# Altium project final embedded smart_watch.PrjPcb
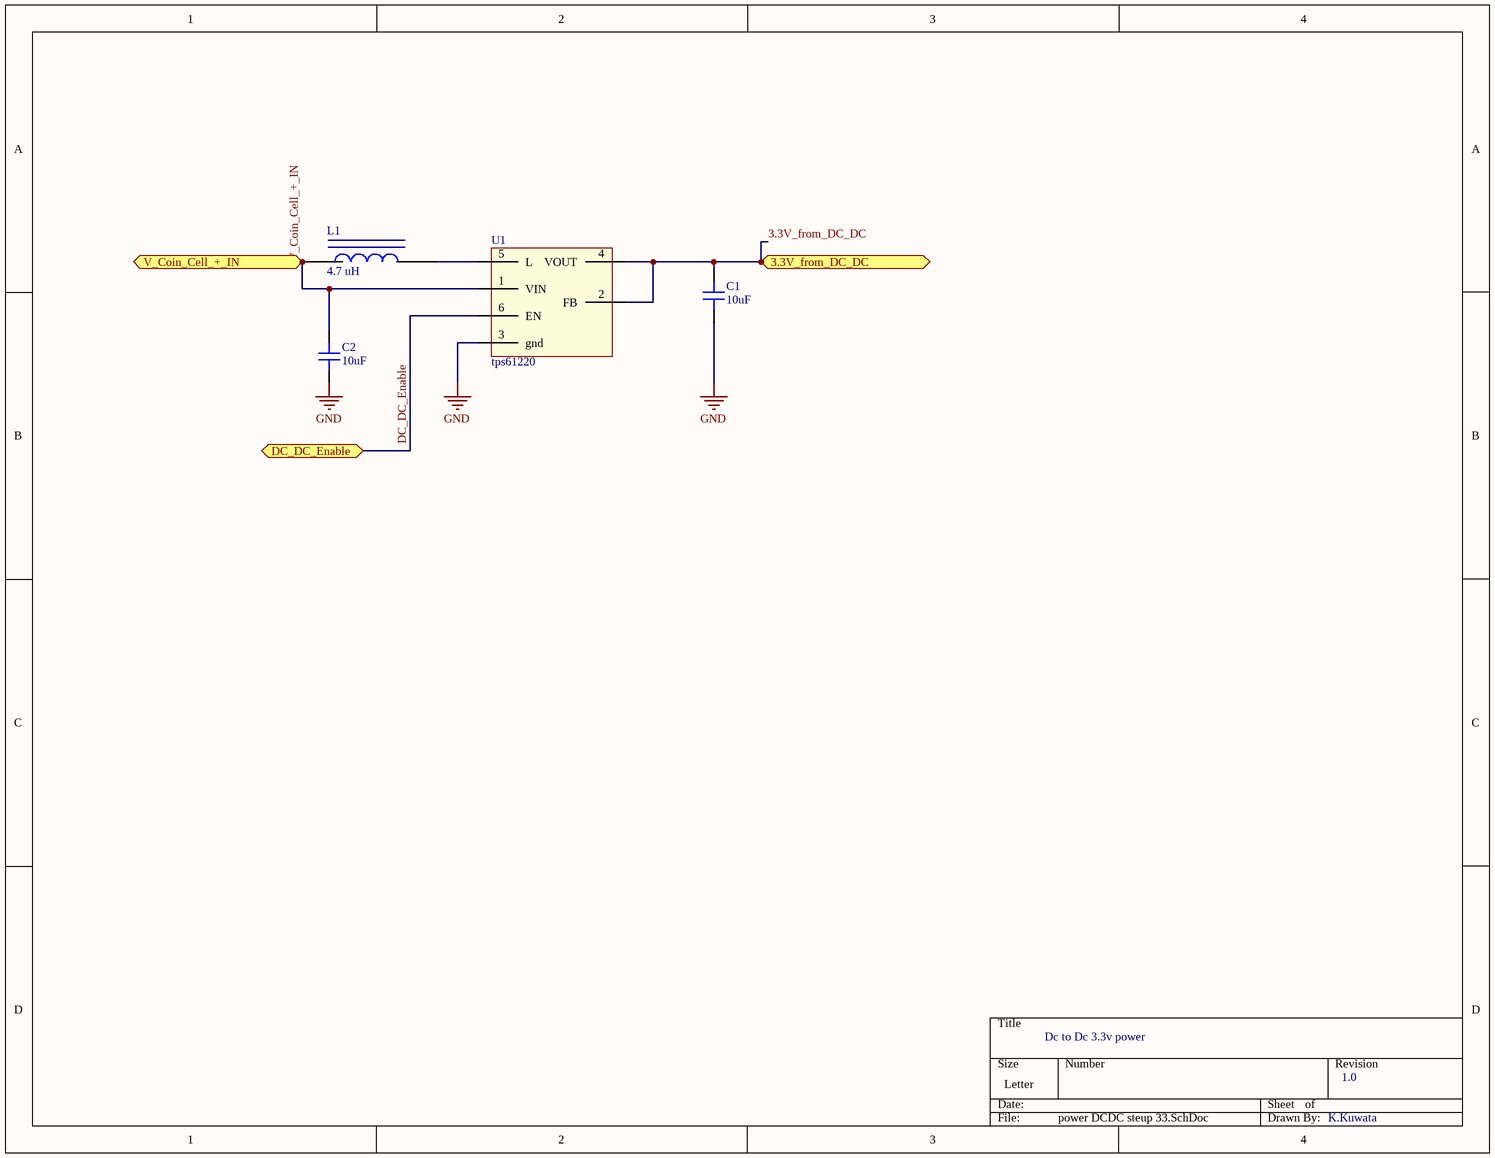
[diagram p0: power DCDC steup 33.SchDoc]
2 sheets, 8 parts. Net scope: flat (ports and power ports of the same name join across sheets).
Sheets:
  power DCDC steup 33.SchDoc
  barometer_temp_humidity.SchDoc

## Sheet power DCDC steup 33.SchDoc
size Letter

### Parts
C1  10uF  [CAP 0402/1005]
C2  10uF  [CAP 0402/1005]
L1  4.7 uH  [4.7 uH 1008 case]
U1  tps61220  [SOT65P210X110-6N]

### Ports
3.3V_from_DC_DC, DC_DC_Enable, V_Coin_Cell_+_IN

### Nets
3.3V_from_DC_DC: C1.2 U1.2(FB) U1.4(VOUT) ; port 3.3V_from_DC_DC
GND: C1.1 C2.1 U1.3(gnd)
DC_DC_Enable: U1.6(EN) ; port DC_DC_Enable
V_Coin_Cell_+_IN: C2.2 L1.1 U1.1(VIN) ; port V_Coin_Cell_+_IN
NetL1_2: L1.2 U1.5(L)

### Notes on the sheet
- Dc to Dc 3.3v power
- 1.0
- K.Kuwata

### Library data of the parts
C1 C2 = C1005X7R1C104K050BC: CAP CER 0.1UF 16V X7R 0402; Manufacturer: TDK Corporation; TemperatureRange: -55C ~ 125C; Tolerance: 10%; Voltage: 10; Value: 10uF; Part Number: C1005X7R1C104K050BC; PartId: 3856; Supplier 1: Digi-Key; Supplier Part Number 1: 445-4952-2-ND; ComponentLink1Description: Datasheet; ComponentLink1URL: https://product.tdk.com/info/en/catalog/datasheets/mlcc_commercial_general_en.pdf; ComponentLink2Description: Digi-Key listing; ComponentLink2URL: http://digikey.com/product-detail/en/C1005X7R1C104K050BC/445-4952-2-ND/2093220; TemperatureCoefficient: X7R; Price: 0.0066; Type: -; Device Package: 0402 (1005 Metric)
L1 = inductor: Value: 4.7 uH

## Sheet barometer_temp_humidity.SchDoc
size Letter
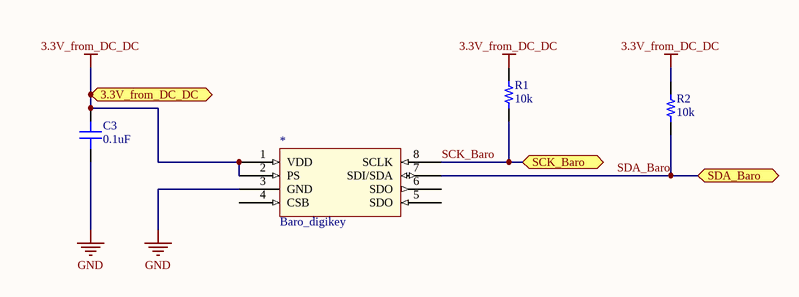
[diagram p1: barometer_temp_humidity.SchDoc]

### Parts
*  Baro_digikey  [MS5607-02BA03]
C3  0.1uF  [CAP 0402/1005]
R1  10k  [RES 0603/1608]
R2  10k  [RES 0603/1608]

### Ports
3.3V_from_DC_DC, SCK_Baro, SDA_Baro

### Nets
3.3V_from_DC_DC: *.1(VDD) *.2(PS) C3.2 R1.2 R2.2 ; port 3.3V_from_DC_DC
GND: *.3(GND) C3.1
SCK_Baro: *.8(SCLK) R1.1 ; port SCK_Baro
SDA_Baro: *.7(SDI/SDA) R2.1 ; port SDA_Baro

Not connected (* = marked no-connect by the designer): * 4(CSB) 5(SDO) 6(SDO)

### Library data of the parts
* = Baro_digikey: 223-1198-1-ND baro
C3 = C1005X7R1C104K050BC: CAP CER 0.1UF 16V X7R 0402; Manufacturer: TDK Corporation; TemperatureRange: -55C ~ 125C; Tolerance: 10%; Value: 0.1uF; Part Number: C1005X7R1C104K050BC; PartId: 3856; Supplier 1: Digi-Key; Supplier Part Number 1: 445-4952-2-ND; ComponentLink1Description: Datasheet; ComponentLink1URL: https://product.tdk.com/info/en/catalog/datasheets/mlcc_commercial_general_en.pdf; ComponentLink2Description: Digi-Key listing; ComponentLink2URL: http://digikey.com/product-detail/en/C1005X7R1C104K050BC/445-4952-2-ND/2093220; TemperatureCoefficient: X7R; Voltage: 16V; Price: 0.0066; Type: -; Device Package: 0402 (1005 Metric)
R1 R2 = ERJ-3EKF1001V: RES SMD 1K OHM 1% 1/10W 0603; Manufacturer: Panasonic Electronic Components; TemperatureRange: -55C ~ 155C; TemperatureCoefficient: 100ppm/C; PowerRating: 0.1W, 1/10W; Value: 10k; Part Number: ERJ-3EKF1001V; PartId: 885; Supplier 1: Digi-Key; Supplier Part Number 1: P1.00KHTR-ND; ComponentLink1Description: Datasheet; ComponentLink1URL: http://industrial.panasonic.com/www-cgi/jvcr13pz.cgi?E+PZ+3+AOA0002+ERJ3EKF1001V+7+WW; ComponentLink2Description: Digi-Key listing; ComponentLink2URL: http://digikey.com/product-detail/en/ERJ-3EKF1001V/P1.00KHTR-ND/196032; Tolerance: 1%; Price: 0.0038; Type: Thick Film; Device Package: 0603 (1608 Metric)

## Nets that join several sheets
3.3V_from_DC_DC: power DCDC steup 33 (C1.2 U1.2 U1.4), barometer_temp_humidity (5 pins)
GND: power DCDC steup 33 (C1.1 C2.1 U1.3), barometer_temp_humidity (*.3 C3.1)